# Altium schematic sheet power.SchDoc
size A
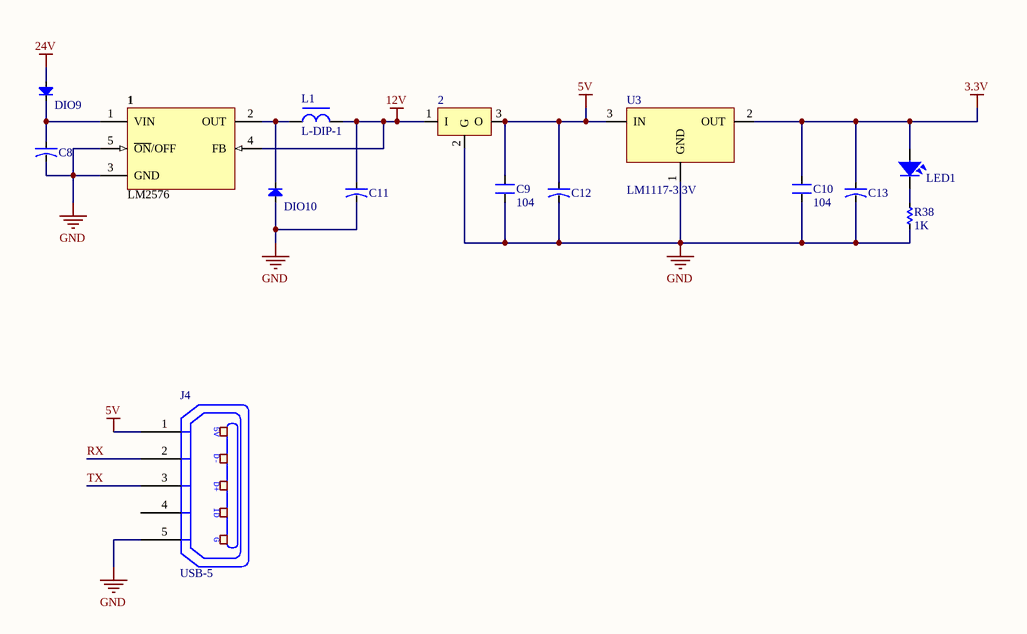
[diagram p0: power.SchDoc]

## Parts
1  LM2576  [TO263]
2  LM78xx  [TO252-123]  (value not drawn)
C8  CN-ALU-SMD  [CAP-ALU-SMD-4.5x5x1.4]  (value not drawn)
C9  104  [SM-CAP-0805]
C10  104  [SM-CAP-0805]
C11  CN-ALU-SMD  [CAP-ALU-SMD-4.5x5x1.4]  (value not drawn)
C12  CN-ALU-SMD  [CAP-ALU-SMD-4.5x5x1.4]  (value not drawn)
C13  CN-ALU-SMD  [CAP-ALU-SMD-4.5x5x1.4]  (value not drawn)
DIO9  Diode SMD  [DIO-SMD-106]  (value not drawn)
DIO10  Diode SMD  [DIO-SMD-106]  (value not drawn)
J4  USB-5  [USB-M4]
L1  L-DIP-1  [L-DIP-M-13.5x6]
LED1  LED  [LED-0805-Blue]  (value not drawn)
R38  1K  [RES-SMD-0805]
U3  LM1117-3.3V  [SOT223]

## Nets
3.3V: C10.2 C13.1 LED1.1 U3.2(OUT)
5V: 2.3(O) C9.2 C12.1 J4.1(P1) U3.3(IN)
12V: 1.4(FB) 2.1(I) C11.1 L1.2
24V: DIO9.1(A)
GND: 1.3(GND) 1.5(~{ON}/OFF) 2.2(G) C8.2 C9.1 C10.1 C11.2 C12.2 C13.2 DIO10.1(A) J4.5(P5) R38.1 U3.1(GND)
RX: J4.2(P2)
TX: J4.3(P3)
Net1_1: 1.1(VIN) C8.1 DIO9.2(K)
Net1_2: 1.2(OUT) DIO10.2(K) L1.1
NetLED1_2: LED1.2 R38.2

Not connected (* = marked no-connect by the designer): J4 4(P4)

## Notes on the sheet
- (in symbol USB-5) 5V; D-; D+; ID; G

## Library data of the parts
1 = LM2576: Max Input Voltage: 12 V; Max Output Current: 3 (6.0 peak) A; Max Output Voltage: mV; Category: IC-Power; Min Input Voltage: mV; Min Output Voltage: mV; Mounting Technology: Surface Mount; Status: Unreleased; Supply Voltage: mV; Temperature Range: -40 to +125 degC
2 = LM78xx: Positive Voltage Regulator; Note: Tab is connected to pin 3 (GND).; Published: 24-Aug-2001; LatestRevisionDate: 17-Jul-2002; LatestRevisionNote: Re-released for DXP Platform.; DatasheetVersion: Apr-1994; PackageVersion: Jul-1998; PackageReference: ISOWATT220AB; Publisher: Altium Limited; PackageDescription: TO, Thru-Hole, Vertical, Heatsink Mounted; 3 In-Line Leads; Pitch 2.54 mm; Pin sequence 1, 3, 2; ComponentLink1Description: Manufacturer Link; ComponentLink1URL: http://www.st.com/; ComponentLink2Description: Datasheet; ComponentLink2URL: http://www.st.com/stonline/products/literature/ds/2146/l78m05c.pdf
C8 C11-C13 = CN-ALU-SMD: Polarized Capacitor (Axial); Published: 8-Jun-2000; LatestRevisionDate: 17-Jul-2002; LatestRevisionNote: Re-released for DXP Platform.; PackageReference: POLAR0.8; Publisher: Altium Limited
C9 C10 = CN: Value: 0,1uF/300V; Designed by: VanDungEvn
DIO9 DIO10 = Diode SMD: Default Diode; Code - JEDEC: DO-214-AB; Value: 1N5007; Published: 8-Jun-2000; Revision: July-2002: Re-released for DXP Platform.; Publisher: Altium Limited
J4 = USB-5: Manufacturer: FCI; Manufacturer Part Number: 10118193-0001LF; Connector Type: USB - micro B; Number of Contacts: 5; Gender: Receptacle; Specifications: USB 2.0; .Creator: MM; .Checked PCB: RF; Supplier 1: Digi-Key; RoHS: RoHS Compliant; Category: Connectors, Interconnects; Stock 1: 28642; Pricing 1: 1=0.46, 10=0.433, 25=0.3712, 50=0.3156, 100=0.3032, 250=0.27224, 500=0.25988 (USD); Packaging: Cut Tape (CT); Mounting Type: Surface Mount, Right Angle, Horizontal; Features: Shielded, Solder Retention; Ingress Protection: -; ComponentLink1URL: http://portal.fciconnect.com/Comergent//fci/drawing/10118193.pdf; ComponentLink1Description: http://portal.fciconnect.com/Comergent//fci/drawing/10118193.pdf; Supplier Part Number 1: 609-4616-1-ND; .Checked SCH: MM
L1 = L-DIP-1: Inductor; Value: 150 mH
LED1 = LED SMD: Value: LED 3 - 5 ly 2 Colour
R38 = Res-SMD: Resistor; Manufacturer: Generic Components; Class: Passive; Published: 08/06/2000; Publisher: Altium Hobart Technology Centre
U3 = LM1117: 800mA Low-Dropout Linear Regulator; Creator: Nguyen Ba Bien; Website: http://group3i.net